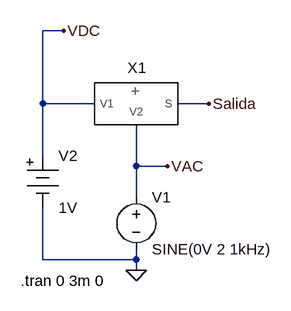
[diagram p0: schematic E8-ejemplo-uso-simbolo-sumador.asc]
E8-ejemplo-uso-simbolo-sumador.asc, the LTspice schematic file:
Version 4
SHEET 1 880 680
WIRE -2272 144 -2304 144
WIRE -2304 256 -2304 144
WIRE -2224 256 -2304 256
WIRE -2048 256 -2096 256
WIRE -2304 336 -2304 256
WIRE -2160 352 -2160 288
WIRE -2112 352 -2160 352
WIRE -2160 400 -2160 352
WIRE -2304 496 -2304 416
WIRE -2160 496 -2160 480
WIRE -2160 496 -2304 496
WIRE -2160 512 -2160 496
FLAG -2160 512 0
FLAG -2048 256 Salida
FLAG -2272 144 VDC
FLAG -2112 352 VAC
SYMBOL voltage -2160 384 R0
WINDOW 123 0 0 Left 0
WINDOW 39 0 0 Left 0
SYMATTR InstName V1
SYMATTR Value SINE(0V 2 1kHz)
SYMBOL Mis_Componentes\\E7-sumador-analogico -2160 256 R0
SYMATTR InstName X1
SYMBOL Misc\\battery -2304 320 R0
SYMATTR InstName V2
SYMATTR Value 1V
TEXT -2338 528 Left 2 !.tran 0 3m 0

The netlist it stands for:
* E8-ejemplo-uso-simbolo-sumador.asc
V1 VAC 0 SINE(0V 2 1kHz)
XX1 VDC VAC Salida E7-sumador-analogico  ; pins V1 V2 S
V2 VDC 0 1V
.tran 0 3m 0
.backanno
.end